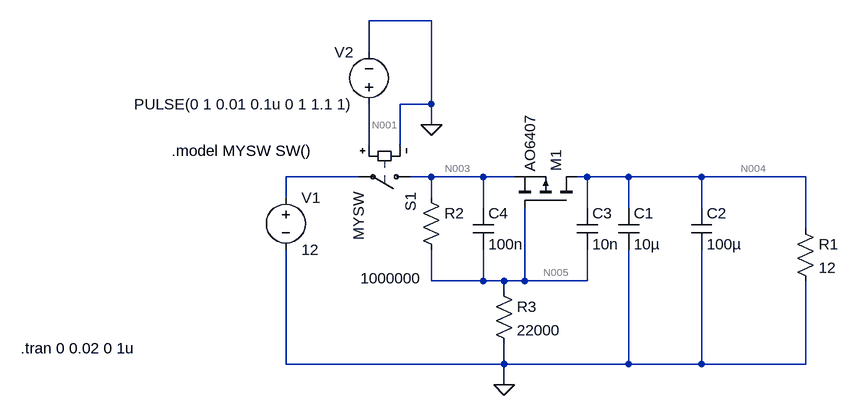
[diagram p0: schematic Soft_Start_Circuit.asc]
Soft_Start_Circuit.asc, the LTspice schematic file:
Version 4.1
SHEET 1 880 680
WIRE 112 -160 16 -160
WIRE 16 -112 16 -160
WIRE 112 -32 112 -160
WIRE 112 -32 64 -32
WIRE 112 0 112 -32
WIRE 16 32 16 -32
WIRE 64 32 64 -32
WIRE 0 80 -112 80
WIRE 112 80 80 80
WIRE 192 80 112 80
WIRE 240 80 192 80
WIRE 352 80 336 80
WIRE 416 80 352 80
WIRE 528 80 416 80
WIRE 688 80 528 80
WIRE -112 112 -112 80
WIRE 112 112 112 80
WIRE 192 128 192 80
WIRE 352 128 352 80
WIRE 416 128 416 80
WIRE 528 128 528 80
WIRE 688 160 688 80
WIRE 112 240 112 192
WIRE 192 240 192 192
WIRE 192 240 112 240
WIRE 224 240 192 240
WIRE 256 240 256 128
WIRE 256 240 224 240
WIRE 352 240 352 192
WIRE 352 240 256 240
WIRE 224 256 224 240
WIRE -112 368 -112 192
WIRE 224 368 224 336
WIRE 224 368 -112 368
WIRE 416 368 416 192
WIRE 416 368 224 368
WIRE 528 368 528 192
WIRE 528 368 416 368
WIRE 688 368 688 240
WIRE 688 368 528 368
WIRE 224 400 224 368
FLAG 224 400 0
FLAG 112 0 0
SYMBOL voltage -112 96 R0
WINDOW 123 0 0 Left 0
WINDOW 39 0 0 Left 0
SYMATTR InstName V1
SYMATTR Value 12
SYMBOL cap 400 128 R0
SYMATTR InstName C1
SYMATTR Value 10µ
SYMBOL cap 512 128 R0
SYMATTR InstName C2
SYMATTR Value 100µ
SYMBOL res 672 144 R0
SYMATTR InstName R1
SYMATTR Value 12
SYMBOL sw 96 80 R90
SYMATTR InstName S1
SYMATTR Value MYSW
SYMBOL voltage 16 -16 R180
WINDOW 0 24 96 Left 2
WINDOW 3 24 16 Left 2
WINDOW 123 0 0 Left 0
WINDOW 39 24 68 Left 2
SYMATTR InstName V2
SYMATTR Value PULSE(0 1 0.01 0.1u 0 1 1.1 1)
SYMBOL pmos 336 128 M270
SYMATTR InstName M1
SYMATTR Value AO6407
SYMBOL res 96 96 R0
WINDOW 3 -93 140 Left 2
SYMATTR InstName R2
SYMATTR Value 1000000
SYMBOL res 208 240 R0
SYMATTR InstName R3
SYMATTR Value 22000
SYMBOL cap 336 128 R0
SYMATTR InstName C3
SYMATTR Value 10n
SYMBOL cap 176 128 R0
SYMATTR InstName C4
SYMATTR Value 100n
TEXT -520 344 Left 2 !.tran 0 0.02 0 1u
TEXT -288 40 Left 2 !.model MYSW SW()

The netlist it stands for:
* Soft_Start_Circuit.asc
V1 N002 0 12
C1 N004 0 10µ
C2 N004 0 100µ
R1 N004 0 12
S1 N003 N002 N001 0 MYSW
V2 N001 0 PULSE(0 1 0.01 0.1u 0 1 1.1 1)
M1 N004 N005 N003 N003 AO6407
R2 N003 N005 1000000
R3 N005 0 22000
C3 N004 N005 10n
C4 N003 N005 100n
.model NMOS NMOS
.model PMOS PMOS
.lib standard.mos
.tran 0 0.02 0 1u
.model MYSW SW()
.backanno
.end

* Results of the author's LTspice run, read from the files saved beside the schematic
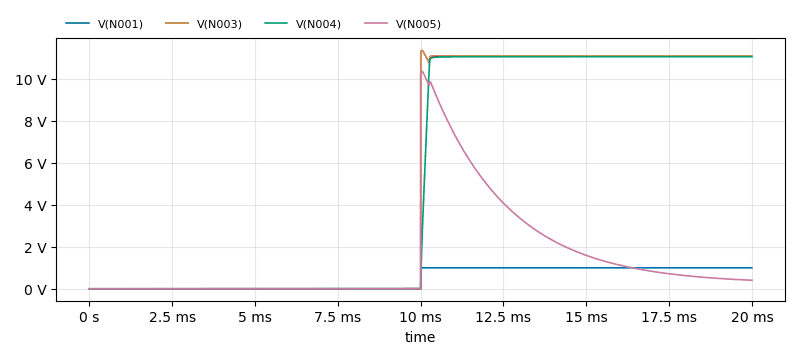
[diagram p1: Transient Analysis of Soft_Start_Circuit.asc, plotted from the saved traces]
* Transient Analysis, 1 run:
*   V(N001): min 0 V, max 1 V, average 499.9 mV, rms 707 mV, last 1 V
*   V(N003): min 0 V, max 11.35 V, average 5.54 V, rms 7.834 V, last 11.08 V
*   V(N004): min 0 V, max 11.05 V, average 5.456 V, rms 7.747 V, last 11.05 V
*   V(N005): min 0 V, max 10.36 V, average 1.398 V, rms 2.76 V, last 406.8 mV